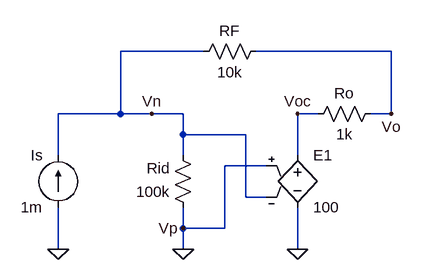
[diagram p0: schematic transresistance.asc]
transresistance.asc, the LTspice schematic file:
Version 4
SHEET 1 880 680
WIRE -176 -32 -304 -32
WIRE 112 -32 -96 -32
WIRE -304 64 -304 -32
WIRE -304 64 -400 64
WIRE -256 64 -304 64
WIRE -208 64 -256 64
WIRE 0 64 -32 64
WIRE 112 64 112 -32
WIRE 112 64 80 64
WIRE -208 96 -208 64
WIRE -112 96 -208 96
WIRE -400 128 -400 64
WIRE -208 128 -208 96
WIRE -32 128 -32 64
WIRE -80 144 -144 144
WIRE -112 192 -112 96
WIRE -80 192 -112 192
WIRE -208 240 -208 208
WIRE -144 240 -144 144
WIRE -144 240 -208 240
WIRE -400 272 -400 208
WIRE -208 272 -208 240
WIRE -32 272 -32 208
FLAG -400 272 0
FLAG -208 272 0
FLAG -32 272 0
FLAG -32 64 Voc
FLAG 112 64 Vo
FLAG -256 64 Vn
FLAG -208 240 Vp
SYMBOL current -400 208 R180
WINDOW 0 24 80 Left 2
WINDOW 3 24 0 Left 2
SYMATTR InstName Is
SYMATTR Value 1m
SYMBOL res -192 224 R180
WINDOW 0 36 76 Left 2
WINDOW 3 36 40 Left 2
SYMATTR InstName Rid
SYMATTR Value 100k
SYMBOL res -192 -16 R270
WINDOW 0 32 56 VTop 2
WINDOW 3 0 56 VBottom 2
SYMATTR InstName RF
SYMATTR Value 10k
SYMBOL e -32 112 R0
SYMATTR InstName E1
SYMATTR Value 100
SYMBOL res 96 48 R90
WINDOW 0 0 56 VBottom 2
WINDOW 3 32 56 VTop 2
SYMATTR InstName Ro
SYMATTR Value 1k

The netlist it stands for:
* transresistance.asc
Is 0 Vn 1m
Rid 0 Vn 100k
RF Vn Vo 10k
E1 Voc 0 0 Vn 100
Ro Vo Voc 1k
.backanno
.end